# Altium schematic sheet power.SchDoc
size A4
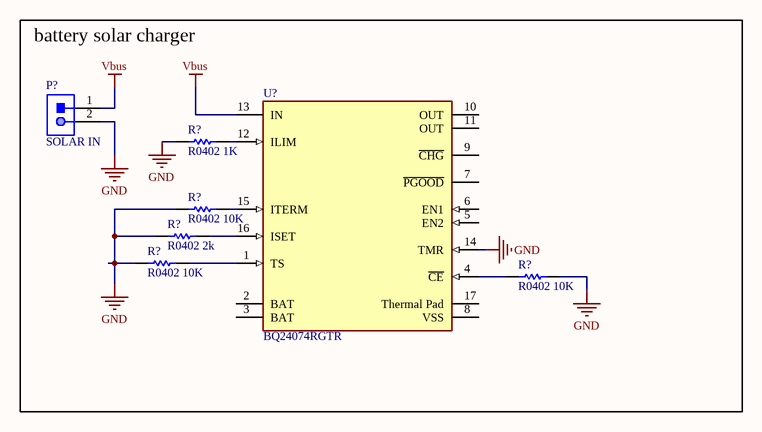
[diagram p0: power.SchDoc]

## Parts
(Parts that share a designator on the sheet are numbered #1, #2 ... from top to bottom, then left to right.)
P?  SOLAR IN  [JST-S2B-PH-K-S_V]  (graphical)
R?#1  R0402 1K  [RESC1005X40X25LL10T10]  (graphical)
R?#2  R0402 10K  [RESC1005X40X25NL10T10]  (graphical)
R?#3  R0402 2k  [RESC1005X40X25ML10T10]  (graphical)
R?#4  R0402 10K  [RESC1005X40X25NL10T10]  (graphical)
R?#5  R0402 10K  [RESC1005X40X25NL10T10]  (graphical)
U?  BQ24074RGTR  [FP-RGT0016C-IPC_B]  (graphical)

## Blocks framed on the sheet
battery solar charger: P? R?#1-R?#5 U?

## Nets
GND: P?.2 R?#1.1 R?#2.1 R?#3.1 R?#4.2 R?#5.2 U?.14(TMR)
Vbus: P?.1 U?.13(IN)
NetR?#1_2: R?#1.2 U?.12(ILIM)
NetR?#2_2: R?#2.2 U?.15(ITERM)
NetR?#3_2: R?#3.2 U?.16(ISET)
NetR?#4_1: R?#4.1 U?.4(~{CE})
NetR?#5_1: R?#5.1 U?.1(TS)

Not connected (* = marked no-connect by the designer): U? 2(BAT) 3(BAT) 5(EN2) 6(EN1) 7(~{PGOOD}) 8(VSS) 9(~{CHG}) 10(OUT) 11(OUT) 17(Thermal_Pad)

## Library data of the parts
P? = CMP-1755-00004-1: Male Header, Pitch 2 mm, 1 x 2 Position, Height 4.8 mm, Tail Length 3.4 mm, -25 to 85 degC, RoHS, Bulk; Case\Package: Radial; Tolerance: 20%; Capacitance: 10 uF; Voltage Rating (DC): 50 V; Packaging: Bulk; ComponentLink1URL: http://www.jst-mfg.com/product/pdf/eng/ePH.pdf; Radiation Hardening: No; Height: 11 mm; Package Quantity: 200; PackageDescription: Male Header, Pitch 2 mm, 1 x 2 Position, Height 4.8 mm, Tail Length 3.4 mm; PackageReference: S2B-PH-K-S; Diameter: 5 mm; Pins: 2; Mount: Through Hole; Max Operating Temperature: 85 degC; Min Operating Temperature: -40 degC; ComponentLink1Description: Datasheet; DatasheetVersion: Dec-12; Length: 11 mm; Lead Pitch: 2 mm; REACH SVHC: No SVHC; Voltage Rating: 50 V; RoHSCompliant: true
R?#1 = CMP-2002-04692-1: Part Number: CR0402-FX-1001GLF; Manufacturer: Bourns
R?#2 R?#4 R?#5 = CMP-2002-04694-1: Manufacturer: Bourns; Part Number: CR0402-FX-1002GLF
R?#3 = CMP-2002-04900-1: Manufacturer: Bourns; Part Number: CR0402-FX-2001GLF
U? = CMP-0321-00220-3: IC LI-ION CHARGE MGMT 16-QFN; Fault Protection: Over Voltage; Max Charge Current: 1.5A; Interface: USB; Max Supply Voltage: 10.2V; Number of Cells: 1; Battery Pack Voltage: 4.2V; Min Supply Voltage: 4.35V; Battery Chemistry: LITHIUM-ION; Min Input Voltage: 4.3V; Lead Free: Lead Free; Max Operating Temperature: 125°C; RoHS Compliant: Yes; Contact Plating: Gold; Min Operating Temperature: -40°C; Weight: 0.000808oz; Package Quantity: 3000; Radiation Hardening: No; Case/Package: VQFN; Output Voltage: 4.2V; Packaging: Tape and Reel; Series: -; Output Current: 1.5A; Number of Pins: 16